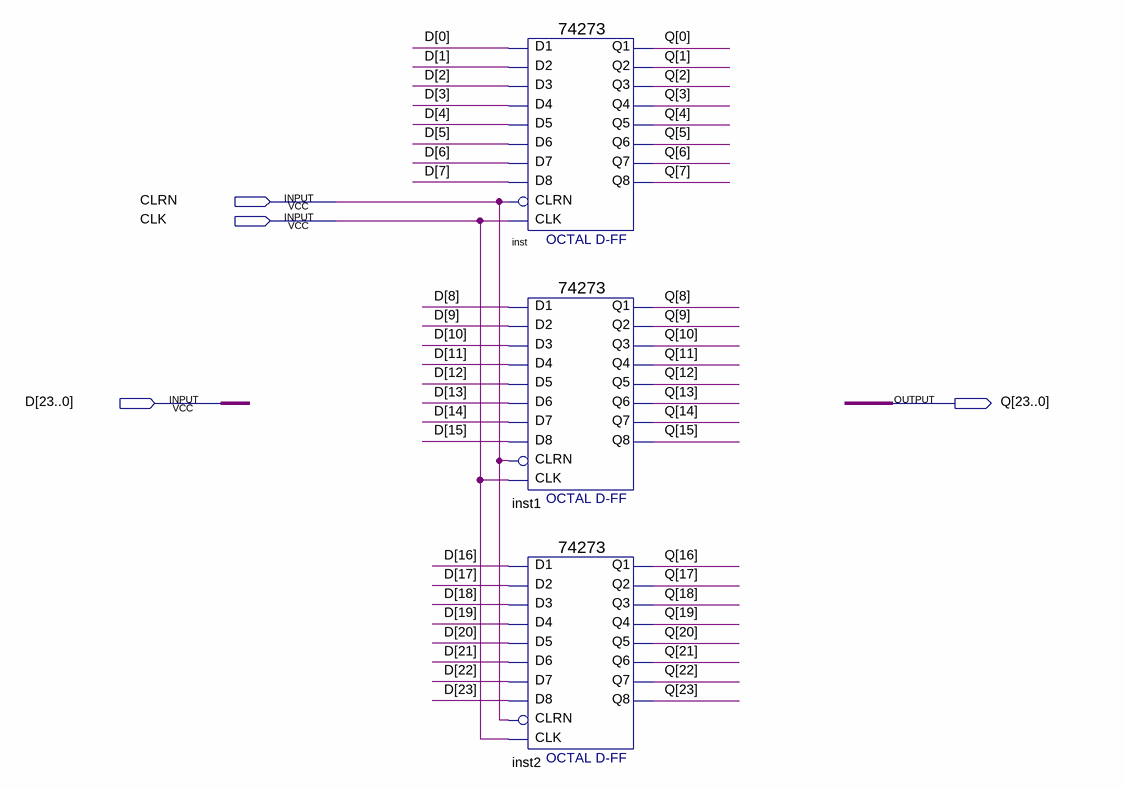
[diagram p0: schematic sheet]
// Quartus schematic uIR.bdf as structural Verilog: 3 symbols, 4 pins
module uIR (
  input  CLRN,
  input  CLK,
  input  [23:0] D,
  output [23:0] Q
);

  \74273  inst (
    .D2(D[1]), .D3(D[2]), .D1(D[0]), .D4(D[3]), .D7(D[6]), .D6(D[5]), .D5(D[4]), .D8(D[7]), .CLK(CLK),
    .CLRN(CLRN), .Q4(Q[3]), .Q1(Q[0]), .Q2(Q[1]), .Q3(Q[2]), .Q6(Q[5]), .Q5(Q[4]), .Q7(Q[6]), .Q8(Q[7]));
  \74273  inst1 (
    .D2(D[9]), .D3(D[10]), .D1(D[8]), .D4(D[11]), .D7(D[14]), .D6(D[13]), .D5(D[12]), .D8(D[15]), .CLK(CLK),
    .CLRN(CLRN), .Q4(Q[11]), .Q1(Q[8]), .Q2(Q[9]), .Q3(Q[10]), .Q6(Q[13]), .Q5(Q[12]), .Q7(Q[14]), .Q8(Q[15]));
  \74273  inst2 (
    .D2(D[17]), .D3(D[18]), .D1(D[16]), .D4(D[19]), .D7(D[22]), .D6(D[21]), .D5(D[20]), .D8(D[23]),
    .CLK(CLK), .CLRN(CLRN), .Q4(Q[19]), .Q1(Q[16]), .Q2(Q[17]), .Q3(Q[18]), .Q6(Q[21]), .Q5(Q[20]),
    .Q7(Q[22]), .Q8(Q[23]));
endmodule
